# Altium schematic sheet ADE9000.SchDoc
size A4
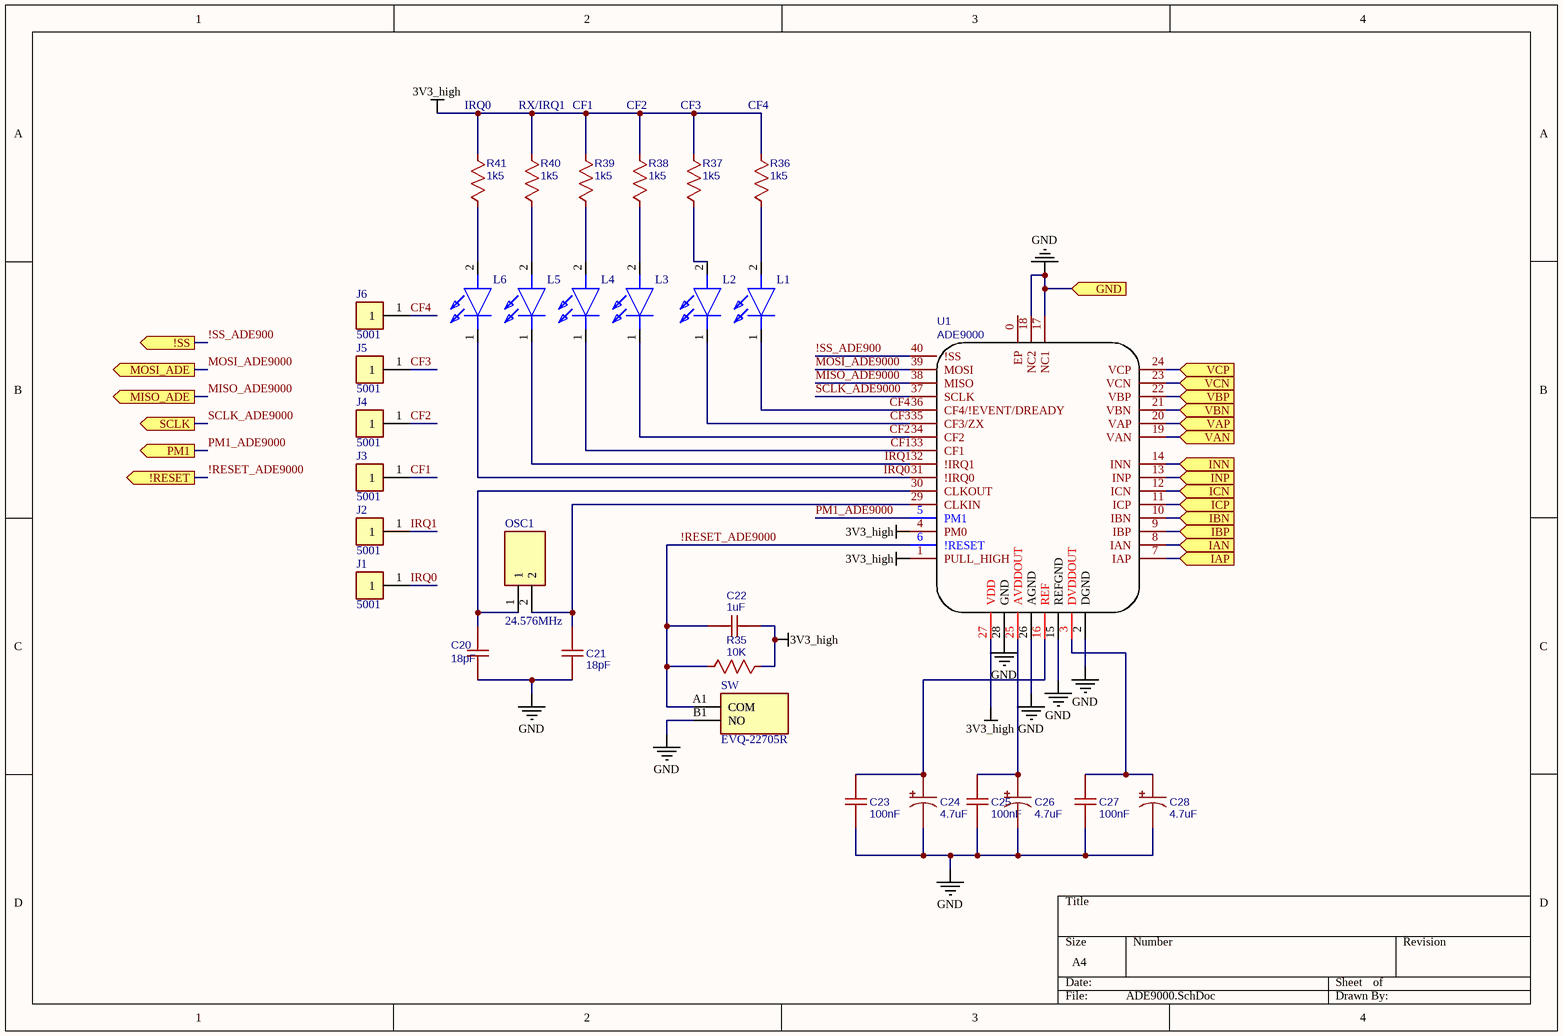
[diagram p0: ADE9000.SchDoc]

## Parts
C20  18pF  [CAPC3216X190]
C21  18pF  [CAPC3216X190]
C22  1uF  [CAPC3216X190]
C23  100nF  [CAPC3216X190]
C24  4.7uF  [CAPC3216X190]
C25  100nF  [CAPC3216X190]
C26  4.7uF  [CAPC3216X190]
C27  100nF  [CAPC3216X190]
C28  4.7uF  [CAPC3216X190]
J1  5001  [KEYSTONE_5001]
J2  5001  [KEYSTONE_5001]
J3  5001  [KEYSTONE_5001]
J4  5001  [KEYSTONE_5001]
J5  5001  [KEYSTONE_5001]
J6  5001  [KEYSTONE_5001]
L1  APT1608LZGCK  [LEDC1608X85N]  (value not drawn)
L2  APT1608LZGCK  [LEDC1608X85N]  (value not drawn)
L3  APT1608LZGCK  [LEDC1608X85N]  (value not drawn)
L4  APT1608LZGCK  [LEDC1608X85N]  (value not drawn)
L5  APT1608LZGCK  [LEDC1608X85N]  (value not drawn)
L6  APT1608LZGCK  [LEDC1608X85N]  (value not drawn)
OSC1  24.576MHz  [HC-49S_1]
R35  10K  [RESC3216X75N]
R36  1k5  [RESC3216X75N]
R37  1k5  [RESC3216X75N]
R38  1k5  [RESC3216X75N]
R39  1k5  [RESC3216X75N]
R40  1k5  [RESC3216X75N]
R41  1k5  [RESC3216X75N]
SW  EVQ-22705R  [EVQ22705R]
U1  ADE9000  [QFN50P600X600X80-41N]

## Ports
!RESET (out), !SS (out), GND (in), IAN (in), IAP (in), IBN (in), IBP (in), ICN (in), ICP (in), INN (in), INP (in), MISO_ADE (out), MOSI_ADE (out), PM1 (out), SCLK (out), VAN (in), VAP (in), VBN (in), VBP (in), VCN (in), VCP (in)

## Nets
3V3_high: C22.1 R35.2 R36.2 R37.2 R38.2 R39.2 R40.2 R41.2 U1.1(PULL_HIGH) U1.4(PM0) U1.27(VDD)
GND: C20.1 C21.1 C23.1 C24.2 C25.1 C26.2 C27.1 C28.2 SW.B1(NO) U1.2(DGND) U1.15(REFGND) U1.17(NC1) U1.18(NC2) U1.26(AGND) U1.28(GND) ; port GND
!RESET_ADE9000: C22.2 R35.1 SW.A1(COM) U1.6(!RESET) ; port !RESET
!SS_ADE900: U1.40(!SS) ; port !SS
CF1: J3.1 L4.1(K) U1.33(CF1)
CF2: J4.1 L3.1(K) U1.34(CF2)
CF3: J5.1 L2.1(K) U1.35(CF3/ZX)
CF4: J6.1 L1.1(K) U1.36(CF4/!EVENT/DREADY)
IAN: U1.8(IAN) ; port IAN
IAP: U1.7(IAP) ; port IAP
IBN: U1.10(IBN) ; port IBN
IBP: U1.9(IBP) ; port IBP
ICN: U1.12(ICN) ; port ICN
ICP: U1.11(ICP) ; port ICP
INN: U1.14(INN) ; port INN
INP: U1.13(INP) ; port INP
IRQ0: J1.1 L6.1(K) U1.31(!IRQ0)
IRQ1: J2.1 L5.1(K) U1.32(!IRQ1)
MISO_ADE9000: U1.38(MISO) ; port MISO_ADE
MOSI_ADE9000: U1.39(MOSI) ; port MOSI_ADE
PM1_ADE9000: U1.5(PM1) ; port PM1
SCLK_ADE9000: U1.37(SCLK) ; port SCLK
VAN: U1.19(VAN) ; port VAN
VAP: U1.20(VAP) ; port VAP
VBN: U1.21(VBN) ; port VBN
VBP: U1.22(VBP) ; port VBP
VCN: U1.23(VCN) ; port VCN
VCP: U1.24(VCP) ; port VCP
NetC20_2: C20.2 OSC1.1 U1.30(CLKOUT)
NetC21_2: C21.2 OSC1.2 U1.29(CLKIN)
NetC23_2: C23.2 C24.1 U1.16(REF)
NetC25_2: C25.2 C26.1 U1.25(AVDDOUT)
NetC27_2: C27.2 C28.1 U1.3(DVDDOUT)
NetL1_2: L1.2(A) R36.1
NetL2_2: L2.2(A) R37.1
NetL3_2: L3.2(A) R38.1
NetL4_2: L4.2(A) R39.1
NetL5_2: L5.2(A) R40.1
NetL6_2: L6.2(A) R41.1

Not connected (* = marked no-connect by the designer): U1 0(EP)

## Notes on the sheet
- IRQ0
- RX/IRQ1
- CF1
- CF2
- CF3
- CF4

## Library data of the parts
C20 C21 = 16pF: nameAlias: Value(F); spicePre: C; spiceSymbolName: Cap_RAD-0.1_US
C22 = 1uF: nameAlias: Value(F); spicePre: C; spiceSymbolName: Cap_RAD-0.1_US
C23 C25 C27 = 100nF: nameAlias: Value(F); spicePre: C; spiceSymbolName: Cap_RAD-0.1_US
C24 C26 C28 = 4.7uF: nameAlias: Value(F); spicePre: C; spiceSymbolName: Cap_Electrolytic(TH)_D5.0XF2.0_US
J1-J6 = 5001: Conn Test Point SKT 1 POS ST Thru-Hole 1 Port; MF: Keystone Electronics Corp.; SnapEDA_Link: https://www.snapeda.com/parts/5001/Keystone%20Electronics/view-part/4775115/?ref=snap; Purchase-URL: https://pricing.snapeda.com/search/part/5001/?ref=eda; Value: *; Availability: Good; MP: 5001; Price: None; Package: None; Check_prices: https://www.snapeda.com/parts/5001/Keystone%20Electronics/view-part/4775115/?ref=eda
L1-L6 = APT1608LZGCK: LED; Manufacturer_Name: Kingbright; Datasheet Link: https://www.mouser.com/datasheet/2/216/APT1608LZGCK-535830.pdf; Height: 0.85mm; Manufacturer_Part_Number: APT1608LZGCK; Arrow Part Number: APT1608LZGCK; Arrow Price/Stock: https://www.arrow.com/en/products/apt1608lzgck/kingbright; Mouser Part Number: 604-APT1608LZGCK; Mouser Price/Stock: https://www.mouser.co.uk/ProductDetail/Kingbright/APT1608LZGCK?qs=6oMev5NRZMFGFINT%2FafRYg%3D%3D
OSC1 = 9B16000381: Crystal or Oscillator; Manufacturer_Name: TXC; Datasheet Link: http://www.txccorp.com/download/products/quartz_crystals/2015TXC_9B_33.pdf; Manufacturer_Part_Number: 9B16000381; Arrow Part Number: 9B16000381
R35-R41 = 10K: nameAlias: Value(Ω); spicePre: R; spiceSymbolName: Res_AXIAL-0.3(1/8W)_US
SW = EVQ-22705R: Switch; Manufacturer_Name: Panasonic; Datasheet Link: https://www.mouser.com/datasheet/2/315/sw_lt_eng_5n_2r-1099494.pdf; Height: 5mm; Manufacturer_Part_Number: EVQ-22705R; Arrow Part Number: EVQ-22705R; Arrow Price/Stock: https://www.arrow.com/en/products/evq-22705r/panasonic; Mouser Part Number: 667-EVQ-22705R; Mouser Price/Stock: https://www.mouser.co.uk/ProductDetail/Panasonic/EVQ-22705R?qs=WwqriLBepZv9VD2fPMeXiQ%3D%3D
U1 = ADE9000: BOM_Manufacturer: Analog Devices; BOM_Manufacturer Part: ADE9000ACPZ-RL; BOM_Supplier Part: ADE9000ACPZ-RLCT-ND; BOM_Supplier: Digi-Key; spicePre: U